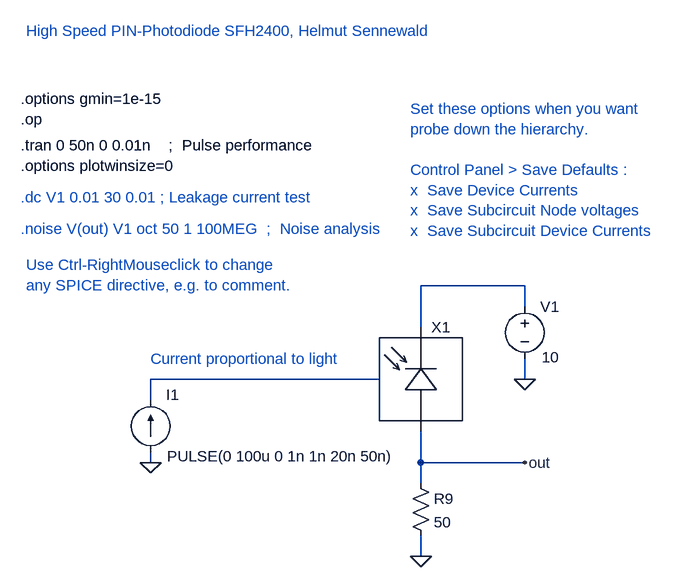
[diagram p0: schematic sfh2400_test_hy.asc]
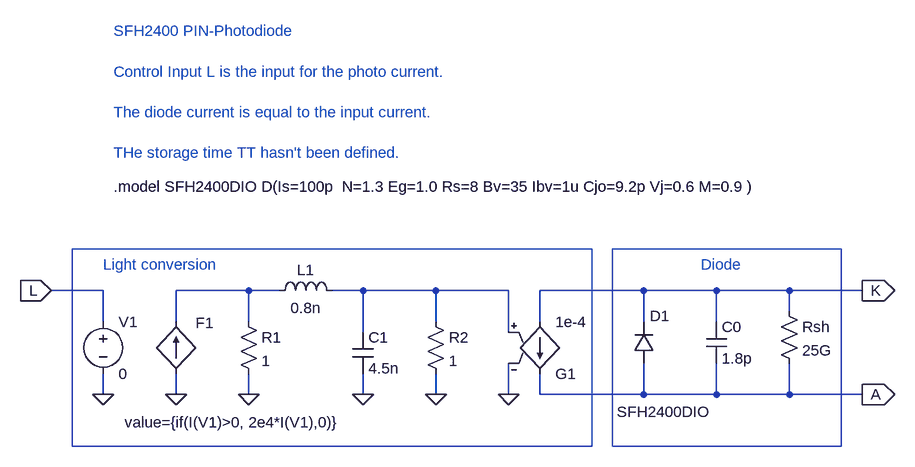
[diagram p1: sub-circuit sfh2400_hy.asc]
sfh2400_test_hy.asc, the LTspice schematic file:
Version 4
SHEET 1 1668 1860
WIRE -656 560 -656 528
WIRE -656 656 -656 640
WIRE -304 528 -656 528
WIRE -240 448 -240 384
WIRE -240 656 -240 608
WIRE -240 688 -240 656
WIRE -240 800 -240 768
WIRE -80 384 -240 384
WIRE -80 416 -80 384
WIRE -80 528 -80 496
WIRE -80 656 -240 656
FLAG -80 528 0
FLAG -240 800 0
FLAG -80 656 out
FLAG -656 656 0
SYMBOL voltage -80 400 R0
WINDOW 123 24 44 Left 0
WINDOW 39 0 0 Left 0
WINDOW 3 26 94 Left 0
SYMATTR Value 10
SYMATTR InstName V1
SYMBOL res -256 672 R0
SYMATTR InstName R9
SYMATTR Value 50
SYMBOL current -656 640 M180
WINDOW 0 24 88 Left 0
WINDOW 3 25 -6 Left 0
WINDOW 123 0 0 Left 0
WINDOW 39 0 0 Left 0
SYMATTR InstName I1
SYMATTR Value PULSE(0 100u 0 1n 1n 20n 50n)
SYMBOL sfh2400_hy -240 528 R0
SYMATTR InstName X1
TEXT -856 128 Left 0 !.op
TEXT -856 96 Left 0 !.options gmin=1e-15
TEXT -856 296 Left 0 ;.noise V(out) V1 oct 50 1 100MEG  ;  Noise analysis
TEXT -848 -8 Left 0 ;High Speed PIN-Photodiode SFH2400, Helmut Sennewald
TEXT -856 168 Left 0 !.tran 0 50n 0 0.01n    ;  Pulse performance\n.options plotwinsize=0
TEXT -856 248 Left 0 ;.dc V1 0.01 30 0.01 ; Leakage current test
TEXT -256 112 Left 0 ;Set these options when you want \nprobe down the hierarchy.\n \nControl Panel > Save Defaults : \nx  Save Device Currents\nx  Save Subcircuit Node voltages\nx  Save Subcircuit Device Currents
TEXT -848 352 Left 0 ;Use Ctrl-RightMouseclick to change \nany SPICE directive, e.g. to comment.
TEXT -656 496 Left 0 ;Current proportional to light

sfh2400_hy.asc, the sub-circuit schematic file:
Version 4
SHEET 1 1668 1860
WIRE -272 512 -352 512
WIRE -272 560 -272 512
WIRE -272 672 -272 640
WIRE -160 560 -160 512
WIRE -160 672 -160 640
WIRE -48 512 -160 512
WIRE -48 560 -48 512
WIRE -48 672 -48 640
WIRE 0 512 -48 512
WIRE 128 512 80 512
WIRE 128 576 128 512
WIRE 128 672 128 640
WIRE 240 512 128 512
WIRE 240 560 240 512
WIRE 240 672 240 640
WIRE 352 512 240 512
WIRE 352 576 352 512
WIRE 352 672 352 624
WIRE 400 560 400 512
WIRE 400 672 400 640
WIRE 560 512 400 512
WIRE 560 560 560 512
WIRE 560 672 400 672
WIRE 560 672 560 624
WIRE 672 512 560 512
WIRE 672 560 672 512
WIRE 672 672 560 672
WIRE 672 672 672 624
WIRE 784 512 672 512
WIRE 784 544 784 512
WIRE 784 672 672 672
WIRE 784 672 784 624
WIRE 896 512 784 512
WIRE 896 672 784 672
FLAG -272 672 0
FLAG -160 672 0
FLAG -48 672 0
FLAG 128 672 0
FLAG 352 672 0
FLAG 240 672 0
FLAG -352 512 L
IOPIN -352 512 In
FLAG 896 512 K
IOPIN 896 512 Out
FLAG 896 672 A
IOPIN 896 672 Out
SYMBOL cap 656 560 R0
SYMATTR InstName C0
SYMATTR Value 1.8p
SYMBOL res 768 528 R0
SYMATTR InstName Rsh
SYMATTR Value 25G
SYMBOL voltage -272 544 R0
SYMATTR InstName V1
SYMATTR Value 0
SYMBOL f -160 640 R180
WINDOW 0 -59 78 Left 0
WINDOW 3 -254 -75 Left 0
SYMATTR InstName F1
SYMATTR Value value={if(I(V1)>0, 2e4*I(V1),0)}
SYMBOL res -64 544 R0
SYMATTR InstName R1
SYMATTR Value 1
SYMBOL cap 112 576 R0
SYMATTR InstName C1
SYMATTR Value 4.5n
SYMBOL g2 400 656 M180
SYMATTR InstName G1
SYMATTR Value 1e-4
SYMBOL ind -16 528 R270
WINDOW 0 32 56 VTop 0
WINDOW 3 5 56 VBottom 0
SYMATTR InstName L1
SYMATTR Value 0.8n
SYMBOL res 224 544 R0
SYMATTR InstName R2
SYMATTR Value 1
SYMBOL diode 576 624 R180
WINDOW 0 -24 73 Left 0
WINDOW 3 -87 -75 Left 0
SYMATTR InstName D1
SYMATTR Value SFH2400DIO
TEXT -256 352 Left 0 !.model SFH2400DIO D(Is=100p  N=1.3 Eg=1.0 Rs=8 Bv=35 Ibv=1u Cjo=9.2p Vj=0.6 M=0.9 )
TEXT -256 112 Left 0 ;SFH2400 PIN-Photodiode\n \nControl Input L is the input for the photo current.\n \nThe diode current is equal to the input current.\n \nTHe storage time TT hasn't been defined.
TEXT 648 472 Left 0 ;Diode
TEXT -272 472 Left 0 ;Light conversion
RECTANGLE Normal 480 752 -320 448
RECTANGLE Normal 864 752 512 448

The netlist it stands for:
* sfh2400_test_hy.asc
V1 N002 0 10
R9 out 0 50
I1 0 N001 PULSE(0 100u 0 1n 1n 20n 50n)
XX1 out N002 N001 sfh2400_hy

* block symbol definitions
.subckt sfh2400_hy A K L
C0 K A 1.8p
Rsh K A 25G
V1 L 0 0
F1 0 N001 value={if(I(V1)>0, 2e4*I(V1),0)}
R1 N001 0 1
C1 N002 0 4.5n
G1 K A N002 0 1e-4
L1 N001 N002 0.8n
R2 N002 0 1
D1 A K SFH2400DIO
.model SFH2400DIO D(Is=100p  N=1.3 Eg=1.0 Rs=8 Bv=35 Ibv=1u Cjo=9.2p Vj=0.6 M=0.9 )
* SFH2400 PIN-Photodiode
* Control Input L is the input for the photo current.
* The diode current is equal to the input current.
* THe storage time TT hasn't been defined.
* Diode
* Light conversion
.ends sfh2400_hy

.model D D
.lib standard.dio
.op
.options gmin=1e-15
* .noise V(out) V1 oct 50 1 100MEG  ;  Noise analysis
* High Speed PIN-Photodiode SFH2400, Helmut Sennewald
.tran 0 50n 0 0.01n    ;  Pulse performance
.options plotwinsize=0
* .dc V1 0.01 30 0.01 ; Leakage current test
* Set these options when you want
* probe down the hierarchy.
* Control Panel > Save Defaults :
* x  Save Device Currents
* x  Save Subcircuit Node voltages
* x  Save Subcircuit Device Currents
* Use Ctrl-RightMouseclick to change
* any SPICE directive, e.g. to comment.
* Current proportional to light
.backanno
.end